# EAGLE design design (EAGLE 9.5.2)
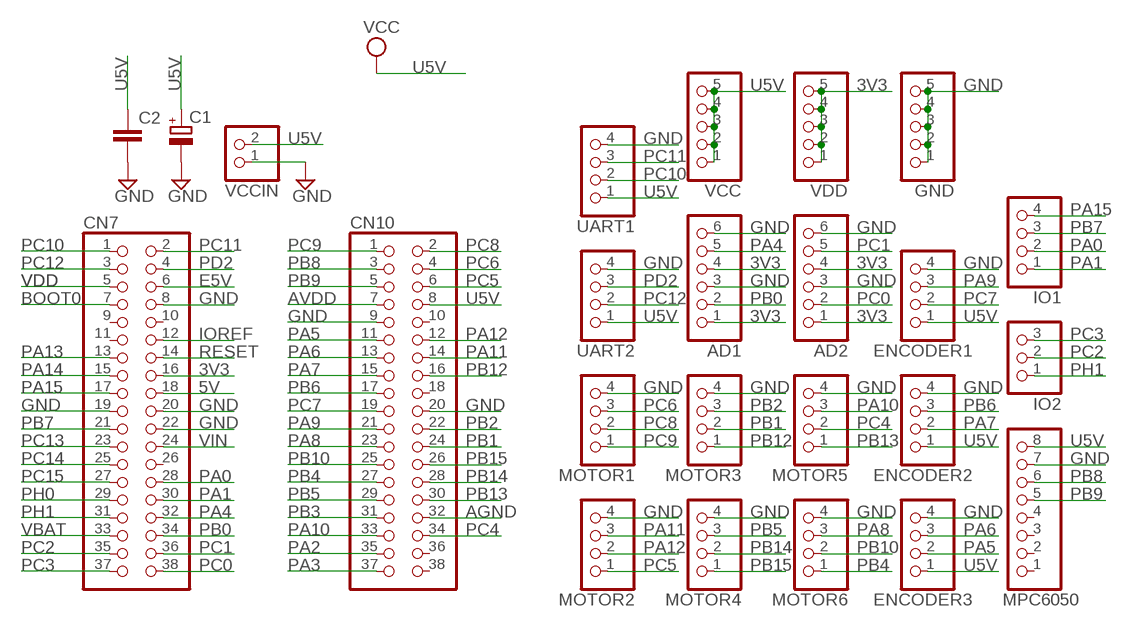
[diagram p0: schematic, sheet 1]

## Parts
AD1  ABOUTERS_6PIN  [22-23-2061]
AD2  ABOUTERS_6PIN  [22-23-2061]
C1  CPOL-EUE2.5-7  [E2,5-7]
C2  C-EU025-024X044  [C025-024X044]
CN7  PINHD-2X19  [2X19]
CN10  PINHD-2X19  [2X19]
ENCODER1  ABOUTERS_4PIN  [22-23-2041]
ENCODER2  ABOUTERS_4PIN  [22-23-2041]
ENCODER3  ABOUTERS_4PIN  [22-23-2041]
GND  ABOUTERS_5PIN  [22-23-2051]
IO1  ABOUTERS_4PIN  [22-23-2041]
IO2  ABOUTERS_3PIN  [22-23-2031]
MOTOR1  ABOUTERS_4PIN  [22-23-2041]
MOTOR2  ABOUTERS_4PIN  [22-23-2041]
MOTOR3  ABOUTERS_4PIN  [22-23-2041]
MOTOR4  ABOUTERS_4PIN  [22-23-2041]
MOTOR5  ABOUTERS_4PIN  [22-23-2041]
MOTOR6  ABOUTERS_4PIN  [22-23-2041]
MPC6050  ABOUTERS_8PIN  [22-23-2081]
UART1  ABOUTERS_4PIN  [22-23-2041]
UART2  ABOUTERS_4PIN  [22-23-2041]
VCC  ABOUTERS_5PIN  [22-23-2051]
VCCIN  ABOUTERS_2PIN  [22-23-2021]
VDD  ABOUTERS_5PIN  [22-23-2051]

## Nets
3V3: AD1.1 AD1.4 AD2.1 AD2.4 CN7.16 VDD.1 VDD.2 VDD.3 VDD.4 VDD.5
5V: CN7.18
AGND: CN10.32
AVDD: CN10.7
BOOT0: CN7.7
E5V: CN7.6
GND: AD1.3 AD1.6 AD2.3 AD2.6 C1.- C2.2 CN7.8 CN7.19 CN7.20 CN7.22 CN10.9 CN10.20 ENCODER1.4 ENCODER2.4 ENCODER3.4 GND.1 GND.2 GND.3 GND.4 GND.5 MOTOR1.4 MOTOR2.4 MOTOR3.4 MOTOR4.4 MOTOR5.4 MOTOR6.4 MPC6050.7 UART1.4 UART2.4 VCCIN.1
IOREF: CN7.12
PA0: CN7.28 IO1.2
PA1: CN7.30 IO1.1
PA2: CN10.35
PA3: CN10.37
PA4: AD1.5 CN7.32
PA5: CN10.11 ENCODER3.2
PA6: CN10.13 ENCODER3.3
PA7: CN10.15 ENCODER2.2
PA8: CN10.23 MOTOR6.3
PA9: CN10.21 ENCODER1.3
PA10: CN10.33 MOTOR5.3
PA11: CN10.14 MOTOR2.3
PA12: CN10.12 MOTOR2.2
PA13: CN7.13
PA14: CN7.15
PA15: CN7.17 IO1.4
PB0: AD1.2 CN7.34
PB1: CN10.24 MOTOR3.2
PB2: CN10.22 MOTOR3.3
PB3: CN10.31
PB4: CN10.27 MOTOR6.1
PB5: CN10.29 MOTOR4.3
PB6: CN10.17 ENCODER2.3
PB7: CN7.21 IO1.3
PB8: CN10.3 MPC6050.6
PB9: CN10.5 MPC6050.5
PB10: CN10.25 MOTOR6.2
PB12: CN10.16 MOTOR3.1
PB13: CN10.30 MOTOR5.1
PB14: CN10.28 MOTOR4.2
PB15: CN10.26 MOTOR4.1
PC0: AD2.2 CN7.38
PC1: AD2.5 CN7.36
PC2: CN7.35 IO2.2
PC3: CN7.37 IO2.3
PC4: CN10.34 MOTOR5.2
PC5: CN10.6 MOTOR2.1
PC6: CN10.4 MOTOR1.3
PC7: CN10.19 ENCODER1.2
PC8: CN10.2 MOTOR1.2
PC9: CN10.1 MOTOR1.1
PC10: CN7.1 UART1.2
PC11: CN7.2 UART1.3
PC12: CN7.3 UART2.2
PC13: CN7.23
PC14: CN7.25
PC15: CN7.27
PD2: CN7.4 UART2.3
PH0: CN7.29
PH1: CN7.31 IO2.1
RESET: CN7.14
U5V: C1.+ C2.1 CN10.8 ENCODER1.1 ENCODER2.1 ENCODER3.1 MPC6050.8 UART1.1 UART2.1 VCC.1 VCC.2 VCC.3 VCC.4 VCC.5 VCCIN.2 ; supply symbol labelled VCC
VBAT: CN7.33
VDD: CN7.5
VIN: CN7.24
Unconnected: CN7.9 CN7.10 CN7.11 CN7.26 CN10.10 CN10.18 CN10.36 CN10.38 MPC6050.1 MPC6050.2 MPC6050.3 MPC6050.4

## Library data of the parts
AD1 AD2 = abouters_pin :ABOUTERS_6PIN
C1 = rcl:CPOL-EU: POLARIZED CAPACITOR, European symbol; SPICEPREFIX: C
C2 = rcl:C-EU: CAPACITOR, European symbol; SPICEPREFIX: C
CN7 CN10 = pinhead:PINHD-2X19: PIN HEADER
ENCODER1-ENCODER3 IO1 MOTOR1-MOTOR6 UART1 UART2 = abouters_pin :ABOUTERS_4PIN
GND VCC VDD = abouters_pin :ABOUTERS_5PIN
IO2 = abouters_pin :ABOUTERS_3PIN
MPC6050 = abouters_pin :ABOUTERS_8PIN
VCCIN = abouters_pin (1):ABOUTERS_2PIN

## Board
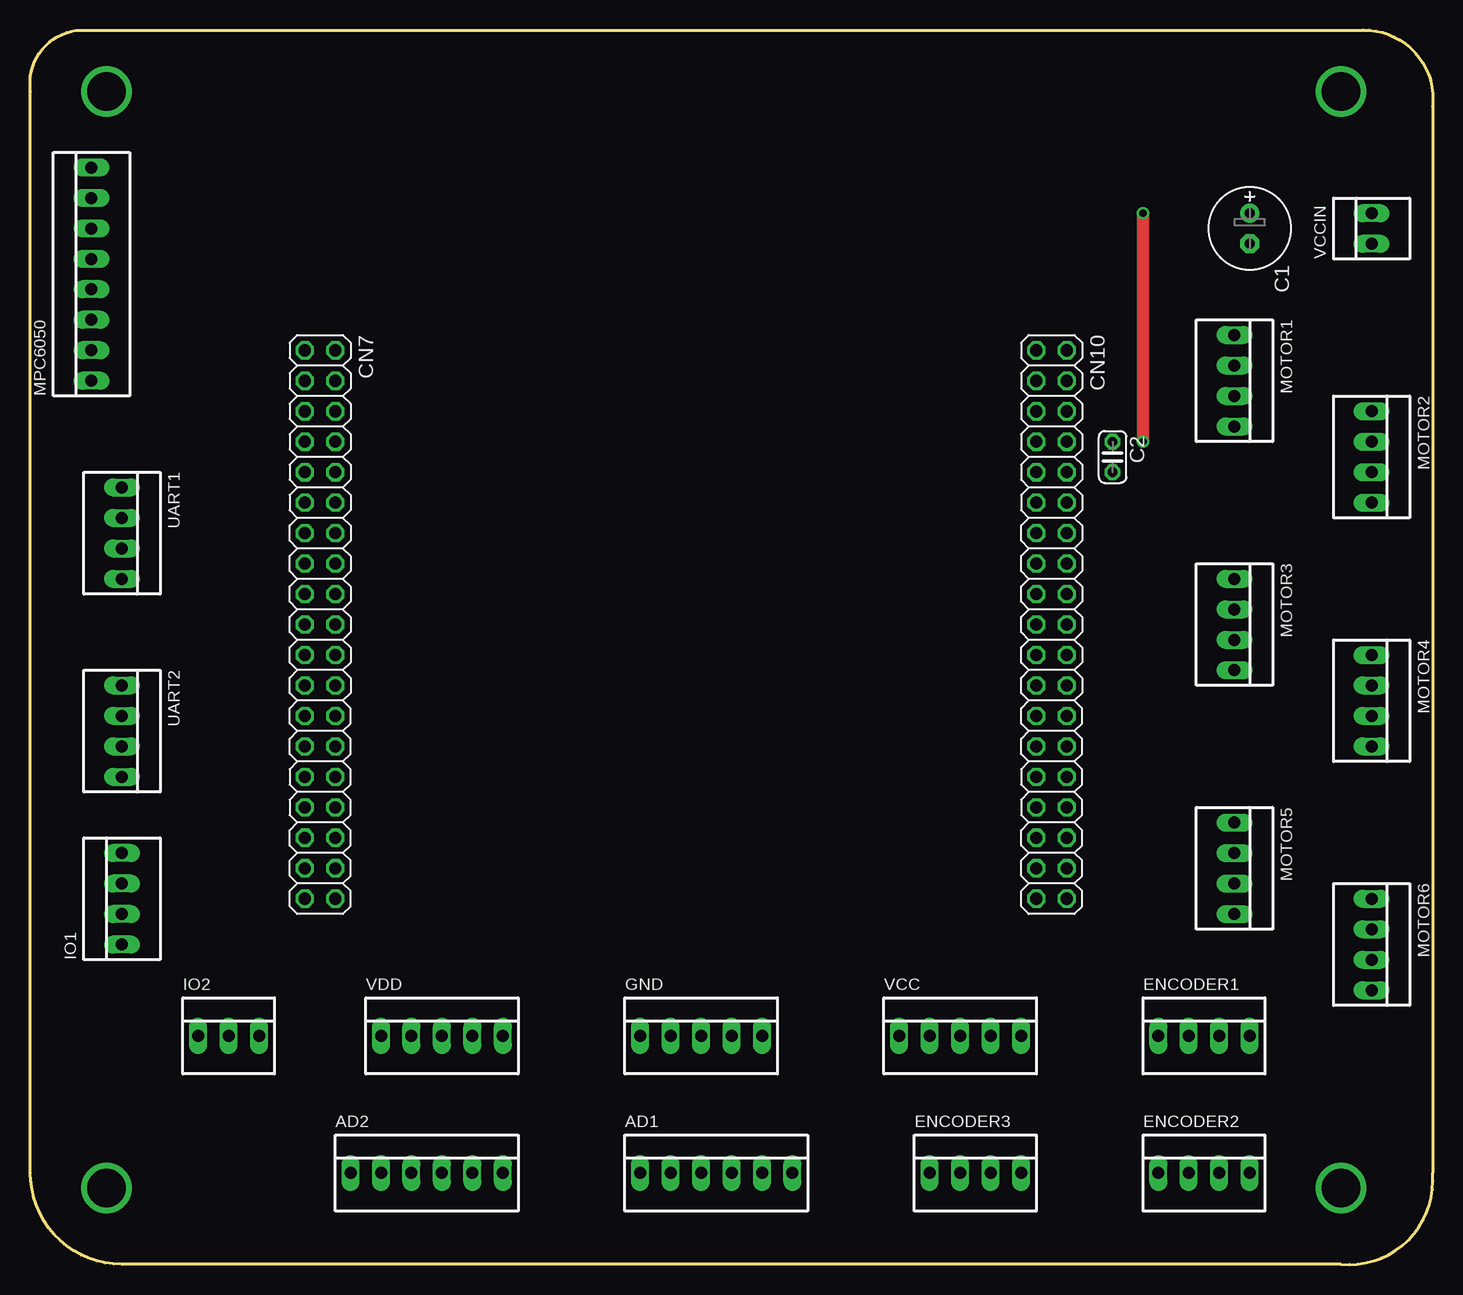
[diagram p1: board, top side]
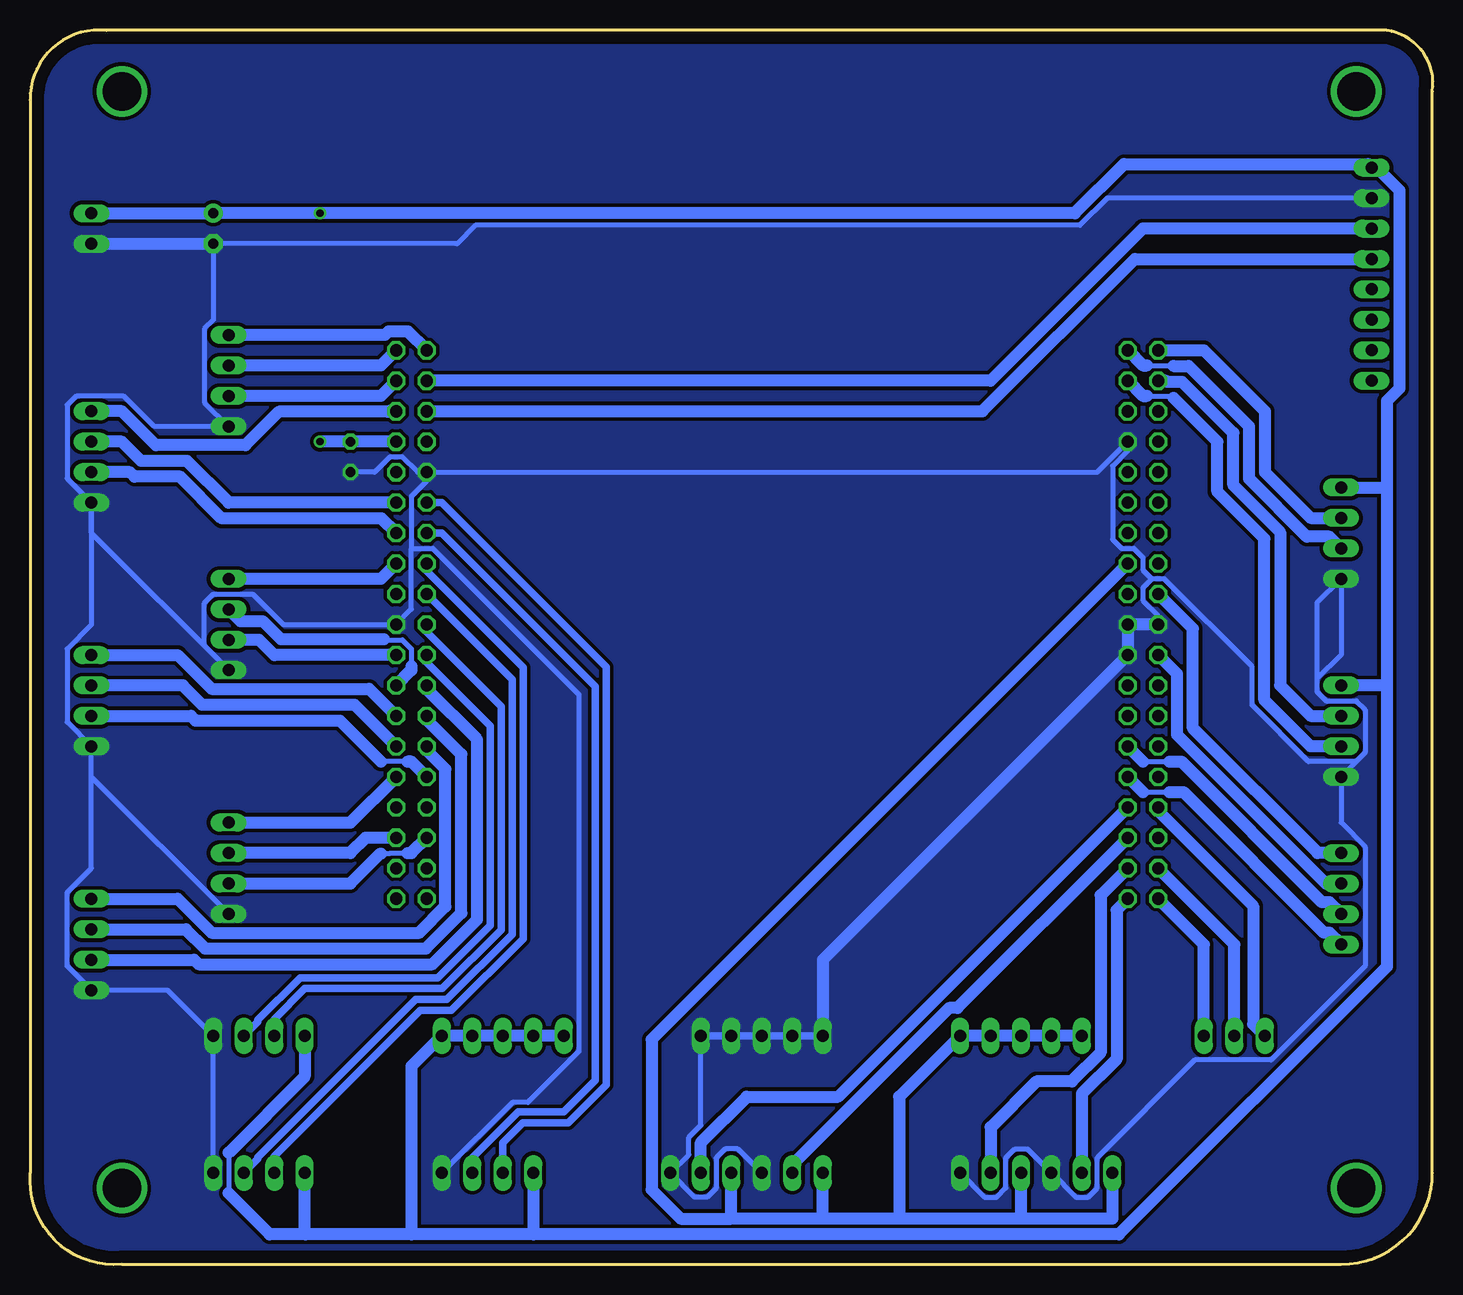
[diagram p2: board, bottom side, seen from below]

Size 116.92 x 102.93 mm. Coordinates in mm from the lower left corner, seen from the top.
Outline: 3.85,102.9 110.53,102.9 arc-103 116.88,96.55 116.88,7.65 arc-100 109.26,0.03 7.66,0.03 arc-90 0.04,7.65 0.04,97.82 arc-90 3.85,102.9
Copper layers (1*16): Top 0.035mm / dielectric 1.5mm / Bottom 0.035mm
Design rules "default *": minimum track width 6mil, minimum drill 0.35mm, track to track 0.3mm, track to pad 0.3mm, pad to pad 0.3mm, via to via 0.3mm, smd to smd 0.3mm, copper to edge 40mil, drill to drill 6mil, minimum pad ring 10mil, minimum via ring 8mil, stop-mask expansion 4mil, vias tented up to drill 0mil, thermal gap 10mil

### Footprints (pad centres in the part's own frame; a part is rotated, then mirrored left to right if it is on the bottom)
22-23-2061 = drill 1 long: 1 -6.35,0; 2 -3.81,0; 3 -1.27,0; 4 1.27,0; 5 3.81,0; 6 6.35,0
E2,5-7 = drill 0.813 pad 1.6: + -1.27,0 | drill 0.813 pad 1.6 octagon: - 1.27,0
C025-024X044 = drill 0.813 octagon: 1 -1.27,0; 2 1.27,0
2X19 = drill 1.016 octagon: 1 -22.86,-1.27; 2 -22.86,1.27; 3 -20.32,-1.27; 4 -20.32,1.27; 5 -17.78,-1.27; 6 -17.78,1.27; 7 -15.24,-1.27; 8 -15.24,1.27; 9 -12.7,-1.27; 10 -12.7,1.27; 11 -10.16,-1.27; 12 -10.16,1.27; 13 -7.62,-1.27; 14 -7.62,1.27; 15 -5.08,-1.27; 16 -5.08,1.27; 17 -2.54,-1.27; 18 -2.54,1.27; 19 0,-1.27; 20 0,1.27; 21 2.54,-1.27; 22 2.54,1.27; 23 5.08,-1.27; 24 5.08,1.27; 25 7.62,-1.27; 26 7.62,1.27; 27 10.16,-1.27; 28 10.16,1.27; 29 12.7,-1.27; 30 12.7,1.27; 31 15.24,-1.27; 32 15.24,1.27; 33 17.78,-1.27; 34 17.78,1.27; 35 20.32,-1.27; 36 20.32,1.27; 37 22.86,-1.27; 38 22.86,1.27
22-23-2041 = drill 1 long: 1 -3.81,0; 2 -1.27,0; 3 1.27,0; 4 3.81,0
22-23-2051 = drill 1 long: 1 -5.08,0; 2 -2.54,0; 3 0,0; 4 2.54,0; 5 5.08,0
22-23-2031 = drill 1 long: 1 -2.54,0; 2 0,0; 3 2.54,0
22-23-2081 = drill 1 long: 1 -8.89,0; 2 -6.35,0; 3 -3.81,0; 4 -1.27,0; 5 1.27,0; 6 3.81,0; 7 6.35,0; 8 8.89,0
22-23-2021 = drill 1 long: 1 -1.27,0; 2 1.27,0

### Placement (x,y rotation side)
AD1  57.19,7.65 0 top
AD2  33.06,7.65 0 top
C1  101.64,86.39 270 top
C2  90.21,67.34 270 top
CN7  24.17,53.37 270 top
CN10  85.13,53.37 270 top
ENCODER1  97.83,19.08 0 top
ENCODER2  97.83,7.65 0 top
ENCODER3  78.78,7.65 0 top
GND  55.92,19.08 0 top
IO1  7.66,30.51 90 top
IO2  16.55,19.08 0 top
MOTOR1  100.37,73.69 270 top
MOTOR2  111.8,67.34 270 top
MOTOR3  100.37,53.37 270 top
MOTOR4  111.8,47.02 270 top
MOTOR5  100.37,33.05 270 top
MOTOR6  111.8,26.7 270 top
MPC6050  5.12,82.58 90 top
UART1  7.66,60.99 270 top
UART2  7.66,44.48 270 top
VCC  77.51,19.08 0 top
VCCIN  111.8,86.39 90 top
VDD  34.33,19.08 0 top

### Tracks (layer width: path | path; a pad name or v marks a point on that pad's centre or on a via)
3V3
  Bottom 1.016: VDD.1 VDD.2 VDD.3 VDD.4 VDD.5 44.49,14 44.49,3.84 | AD2.1 26.71,3.84 34.33,3.84 | 34.33,3.84 AD2.4 | 34.33,3.84 44.49,3.84 | 44.49,3.84 50.84,3.84 | 50.84,3.84 AD1.1 | 50.84,3.84 58.46,3.84 | 58.46,3.84 AD1.4 | CN7.16 65.1,18.79 65.1,6.25 62.69,3.84 58.46,3.84
GND
  Bottom 0.406: CN10.9 84.61,66.07 85.88,67.33 86.92,67.33 88.19,66.07 C2.2 | AD2.6 37.39,5.64 36.35,5.64 35.59,6.4 35.59,8.92 34.85,9.66 33.81,9.66 AD2.3 29.77,5.64 28.73,5.64 27.99,6.37 27.99,8.91 19.83,17.07 13.49,17.07 5.65,24.91 5.65,34.84 7.66,36.85 UART2.4 6.39,41.95 | AD1.3 57.94,9.66 58.98,9.66 59.74,8.9 59.74,6.37 60.48,5.64 61.52,5.64 AD1.6 62.01,9.18 62.01,10.61 61,11.62 GND.5 | 9.67,48.81 9.67,47.77 8.91,47.01 6.39,47.01 5.65,46.27 5.65,42.69 6.39,41.95 | 9.67,48.81 7.66,50.82 UART1.4 9.67,55.17 9.67,48.81 | 23.42,57.17 22.38,57.17 15.07,49.86 15.07,46.65 10.37,41.95 6.39,41.95 | 23.42,57.17 24.17,56.43 24.17,55.38 22.9,54.12 CN7.19 | 23.42,57.17 24.18,57.92 24.18,58.97 24.92,59.71 25.95,59.71 26.71,60.46 26.71,66.59 25.44,67.86 CN7.8 27.98,66.07 CN10.9 | MPC6050.7 27.14,88.93 29.42,86.65 79.79,86.65 81.32,85.12 C1.- 101.64,78.76 102.38,78.02 102.38,71.89 MOTOR1.4 106.56,69.88 109.09,72.41 113.08,72.41 113.81,71.67 113.81,65.55 MOTOR2.4 | CN10.9 83.86,65.32 85.13,64.05 85.13,59.72 | 85.13,59.72 85.13,54.64 CN10.20 95.81,53.37 98.34,55.9 101.65,55.9 102.38,55.16 102.38,51.58 MOTOR3.4 111.8,60.99 MOTOR2.4 | MOTOR2.4 111.8,53.36 113.81,51.35 113.81,45.23 MOTOR4.4 111.8,40.67 | MOTOR5.4 111.8,40.67 | 111.8,40.67 111.8,33.04 113.81,31.03 113.81,24.91 MOTOR6.4 105.45,22.89 ENCODER1.4 ENCODER2.4 | 85.13,59.72 85.12,59.71 83.34,59.71 71.17,47.55 71.17,17.82 71.16,17.81 75.43,13.54 76.69,13.54 ENCODER3.4
  Bottom 0.61: GND.1 GND.2 GND.3 GND.4 GND.5
  Bottom 1.016: VCCIN.1 C1.- | CN7.19 CN7.20 CN7.22 50.84,25.43 GND.1
  pour Bottom (no thermals): 0.04,102.9 116.88,102.9 116.88,0.03 0.04,0.03
N$1  (via drill 3.2)
  other vias: 6.39,6.38
N$2  (via drill 3.2)
  other vias: 109.26,6.38
N$3  (via drill 3.2)
  other vias: 109.26,97.82
N$4  (via drill 3.2)
  other vias: 6.39,97.82
PA0
  Bottom 0.406: 24.17,41.94 21.95,41.94
  Bottom 1.016: IO1.2 8.64,30.22 9.23,30.22 20.95,41.94 21.95,41.94 | CN7.28 24.17,41.94
PA1
  Bottom 0.406: 24.17,39.4 21.95,39.4
  Bottom 1.016: IO1.1 8.64,27.68 9.06,27.68 20.78,39.4 21.95,39.4 | CN7.30 24.17,39.4
PA4
  Bottom 1.016: AD1.5 61,10.19 57.19,14 49.57,14 CN7.32
PA5
  Bottom 0.61: ENCODER3.2 77.51,10.17 75.86,11.82 72.05,11.82 68.89,14.98 68.89,49.83 82.59,63.53 CN10.11
PA6
  Bottom 0.61: ENCODER3.3 80.05,8.92 76.24,12.73 72.43,12.73 69.8,15.36 69.8,48.2 82.59,60.99 CN10.13
PA7
  Bottom 0.61: ENCODER2.2 96.56,9.04 84.4,21.2 81.79,21.2 75.82,27.18 75.82,49.8 83.86,57.84 CN10.15
PA8
  Bottom 1.016: MOTOR6.3 103.25,25.43 102.86,25.04 83.38,25.04 79.66,28.77 79.66,43.77 83.86,47.97 CN10.23
PA9
  Bottom 0.61: ENCODER1.3 97.92,20.26 97.92,20.4 94.38,23.93 82.92,23.93 78.55,28.31 78.55,44.91 83.86,50.22 CN10.21
PA10
  Bottom 0.406: 87.67,34.27 86.97,34.27 86.92,34.32 85.45,34.32
  Bottom 1.016: CN10.33 85.13,34.32 85.45,34.32 | MOTOR5.3 90.21,31.78 87.72,34.27 87.67,34.27
PA11
  Bottom 1.016: CN10.14 87.62,62.21 100.92,62.21 104.39,65.68 108.2,65.68 108.58,66.07 MOTOR2.3
PA12
  Bottom 1.016: MOTOR2.2 109.26,68.61 107.65,67 103.84,67 100.37,63.53 CN10.12
PA15
  Bottom 1.016: IO1.4 9.61,34.32 20.01,44.72 20.01,53.02 CN7.17
PB0
  Bottom 1.016: CN7.34 39.63,21.39 40.31,21.39 53.38,8.33 AD1.2
PB1
  Bottom 0.406: 87.4,52.14 87.35,52.09 85.88,52.09 85.13,51.35 85.13,49.88
  Bottom 1.016: CN10.24 85.13,49.56 85.13,49.88 | MOTOR3.2 99.39,53.66 97.53,53.66 96.02,52.14 87.4,52.14
PB2
  Bottom 1.016: CN10.22 96.56,50.83 97.83,52.1 MOTOR3.3
PB4
  Bottom 1.016: MOTOR6.1 104.6,30.51 101.77,27.68 84.47,27.68 82.29,29.86 82.29,41.32 83.86,42.89 CN10.27
PB5
  Bottom 0.406: 85.45,41.94 87.67,41.94
  Bottom 1.016: MOTOR4.3 103.5,45.75 103.12,45.36 91.1,45.36 87.67,41.94 | CN10.29 85.13,41.94 85.45,41.94
PB6
  Bottom 0.61: ENCODER2.3 97.92,8.83 97.92,8.97 84.77,22.11 82.17,22.11 76.73,27.55 76.73,48.77 CN10.17
PB7
  Bottom 1.016: IO1.3 8.93,31.78 21.33,44.18 21.33,49.26 CN7.21
PB8
  Bottom 1.016: MPC6050.6 24.17,86.39 36.87,73.69 CN10.3
PB9
  Bottom 1.016: CN10.5 37.55,71.15 24.85,83.85 MPC6050.5
PB10
  Bottom 1.016: MOTOR6.2 103.92,27.97 102.32,26.36 83.93,26.36 80.97,29.31 80.97,42.54 83.86,45.43 CN10.25
PB12
  Bottom 1.016: CN10.16 87.67,57.18 MOTOR3.1
PB13
  Bottom 1.016: MOTOR5.1 90.21,36.86 CN10.30
PB14
  Bottom 1.016: CN10.28 89.87,46.68 102.57,46.68 104.18,48.29 MOTOR4.2
PB15
  Bottom 1.016: CN10.26 88.65,48 101.77,48 104.6,50.83 MOTOR4.1
PC0
  Bottom 1.016: CN7.38 26.37,29.58 26.37,17.13 29.25,14.25 AD2.2
PC1
  Bottom 1.016: CN7.36 27.69,30.8 27.69,17.68 30.1,15.27 33.06,15.27 36.87,11.46 AD2.5
PC2
  Bottom 1.016: IO2.2 16.55,26.7 CN7.35
PC3
  Bottom 1.016: IO2.3 19.09,26.7 CN7.37
PC4
  Bottom 1.016: CN10.34 88.94,35.59 90.21,34.32 MOTOR5.2
PC5
  Bottom 1.016: CN10.6 87.08,71.15 87.13,71.1 96.18,71.1 98.97,68.32 106.43,68.32 109.26,71.15 MOTOR2.1
PC6
  Bottom 1.016: CN10.4 87.67,72.42 MOTOR1.3
PC7
  Bottom 0.61: ENCODER1.2 96.56,20.47 94.01,23.02 82.54,23.02 77.64,27.93 77.64,46.54 83.86,52.76 CN10.19
PC8
  Bottom 1.016: CN10.2 87.67,74.96 MOTOR1.2
PC9
  Bottom 1.016: MOTOR1.1 87.35,77.5 87.05,77.8 85.43,77.8 CN10.1
PC10
  Bottom 1.016: CN7.1 19.09,76.23 14.01,71.15 14.01,66.07 10.2,62.26 UART1.2
PC11
  Bottom 0.406: 23.85,74.96 21.68,74.96 21.63,74.91
  Bottom 1.016: UART1.3 8.64,60.7 10.5,60.7 15.33,65.52 15.33,69.88 20.36,74.91 21.63,74.91 | CN7.2 24.17,74.96 23.85,74.96
PC12
  Bottom 1.016: UART2.2 10.2,45.75 12.74,48.29 12.74,61.08 16.64,64.98 16.64,69.33 20.91,73.6 22.18,73.6 22.27,73.69 CN7.3
PD2
  Bottom 0.406: 23.85,72.42 21.77,72.42 21.63,72.28
  Bottom 1.016: UART2.3 10.2,43.21 14.06,47.06 14.06,60.53 17.96,64.43 17.96,68.61 21.63,72.28 | CN7.4 24.17,72.42 23.85,72.42
PH1
  Bottom 1.016: IO2.1 14.99,20.06 14.99,29.9 22.9,37.81 CN7.31
U5V  (via drill 0.6)
  Top 1.016: v92.75,68.61 v92.75,87.66
  Bottom 0.406: 100.37,9.34 100.37,5.96
  Bottom 1.016: CN10.8 C2.1 v92.75,68.61 | VCC.1 VCC.2 VCC.3 VCC.4 VCC.5 85.13,16.54 85.13,2.52 | VCCIN.2 C1.+ v92.75,87.66 29.84,87.66 25.74,91.76 5.41,91.76 MPC6050.8 4.7,91.47 2.8,89.58 2.8,73.04 3.85,72 3.85,64.8 | UART1.1 3.85,64.8 | 3.85,64.8 3.85,48.29 | 3.85,48.29 UART2.1 | 3.85,48.29 3.85,24.84 26.17,2.52 74.97,2.52 | ENCODER3.1 74.97,2.52 | 74.97,2.52 85.13,2.52 | 85.13,2.52 93.97,2.52 | 93.97,2.52 94.02,2.57 ENCODER2.1 | 93.97,2.52 96.94,2.52 100.37,5.96 | ENCODER1.1 94.02,15.69 100.37,9.34